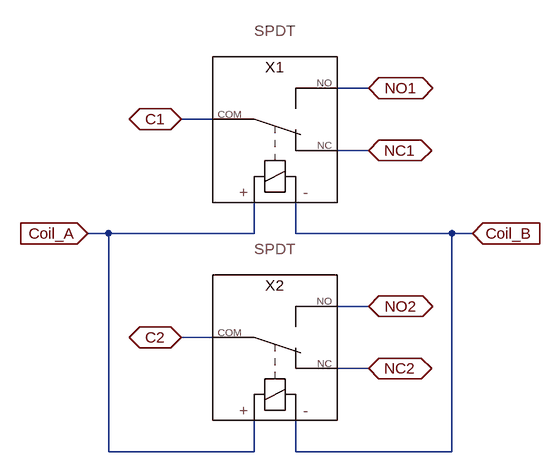
[diagram p0: schematic relay_dpdt.asc]
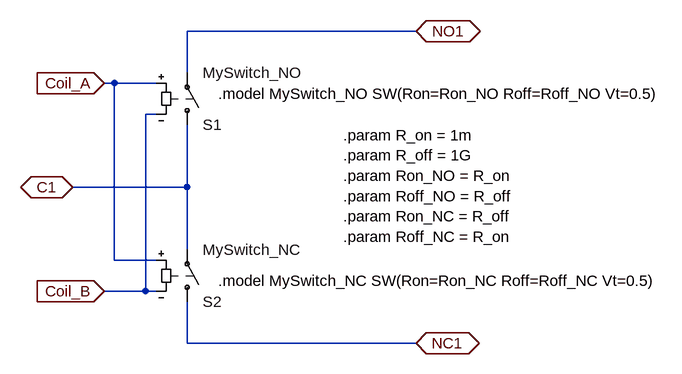
[diagram p1: sub-circuit relay_spdt.asc]
relay_dpdt.asc, the LTspice schematic file:
Version 4
SHEET 1 880 680
WIRE 384 -16 336 -16
WIRE 144 32 96 32
WIRE 384 80 336 80
WIRE -16 208 -48 208
WIRE 208 208 208 160
WIRE 208 208 -16 208
WIRE 272 208 272 160
WIRE 512 208 272 208
WIRE 544 208 512 208
WIRE 384 320 336 320
WIRE 144 368 96 368
WIRE 384 416 336 416
WIRE -16 544 -16 208
WIRE 208 544 208 496
WIRE 208 544 -16 544
WIRE 272 544 272 496
WIRE 512 544 512 208
WIRE 512 544 272 544
FLAG 96 32 C1
IOPIN 96 32 BiDir
FLAG 96 368 C2
IOPIN 96 368 BiDir
FLAG 384 -16 NO1
IOPIN 384 -16 BiDir
FLAG 384 80 NC1
IOPIN 384 80 BiDir
FLAG 384 320 NO2
IOPIN 384 320 BiDir
FLAG 384 416 NC2
IOPIN 384 416 BiDir
FLAG -48 208 Coil_A
IOPIN -48 208 In
FLAG 544 208 Coil_B
IOPIN 544 208 In
SYMBOL Relay_SPDT 240 48 R0
WINDOW 0 0 -96 Center 2
SYMATTR InstName X1
SYMBOL Relay_SPDT 240 384 R0
WINDOW 0 0 -96 Center 2
SYMATTR InstName X2

relay_spdt.asc, the sub-circuit schematic file:
Version 4
SHEET 1 988 680
WIRE 592 -64 240 -64
WIRE 240 0 240 -64
WIRE 128 16 112 16
WIRE 192 16 128 16
WIRE 192 64 176 64
WIRE 240 176 240 80
WIRE 240 176 64 176
WIRE 240 272 240 176
WIRE 128 288 128 16
WIRE 192 288 128 288
WIRE 176 336 176 64
WIRE 176 336 112 336
WIRE 192 336 176 336
WIRE 240 416 240 352
WIRE 592 416 240 416
FLAG 592 -64 NO1
IOPIN 592 -64 BiDir
FLAG 592 416 NC1
IOPIN 592 416 BiDir
FLAG 64 176 C1
IOPIN 64 176 BiDir
FLAG 112 16 Coil_A
IOPIN 112 16 In
FLAG 112 336 Coil_B
IOPIN 112 336 In
SYMBOL sw 240 96 M180
SYMATTR InstName S1
SYMATTR Value MySwitch_NO
SYMBOL sw 240 368 M180
SYMATTR InstName S2
SYMATTR Value MySwitch_NC
TEXT 288 32 Left 2 !.model MySwitch_NO SW(Ron=Ron_NO Roff=Roff_NO Vt=0.5)
TEXT 288 320 Left 2 !.model MySwitch_NC SW(Ron=Ron_NC Roff=Roff_NC Vt=0.5)
TEXT 480 96 Left 2 !.param R_on = 1m\n.param R_off = 1G\n.param Ron_NO = R_on\n.param Roff_NO = R_off\n.param Ron_NC = R_off\n.param Roff_NC = R_on

The netlist it stands for:
* relay_dpdt.asc
XX1 Coil_A Coil_B C1 NO1 NC1 relay_spdt
XX2 Coil_A Coil_B C2 NO2 NC2 relay_spdt

* block symbol definitions
.subckt relay_spdt Coil_A Coil_B C1 NO1 NC1
S1 C1 NO1 Coil_A Coil_B MySwitch_NO
S2 NC1 C1 Coil_A Coil_B MySwitch_NC
.model MySwitch_NO SW(Ron=Ron_NO Roff=Roff_NO Vt=0.5)
.model MySwitch_NC SW(Ron=Ron_NC Roff=Roff_NC Vt=0.5)
.param R_on = 1m
.param R_off = 1G
.param Ron_NO = R_on
.param Roff_NO = R_off
.param Ron_NC = R_off
.param Roff_NC = R_on
.ends relay_spdt

.backanno
.end